# Altium schematic sheet Battery.SchDoc
size A3 portrait
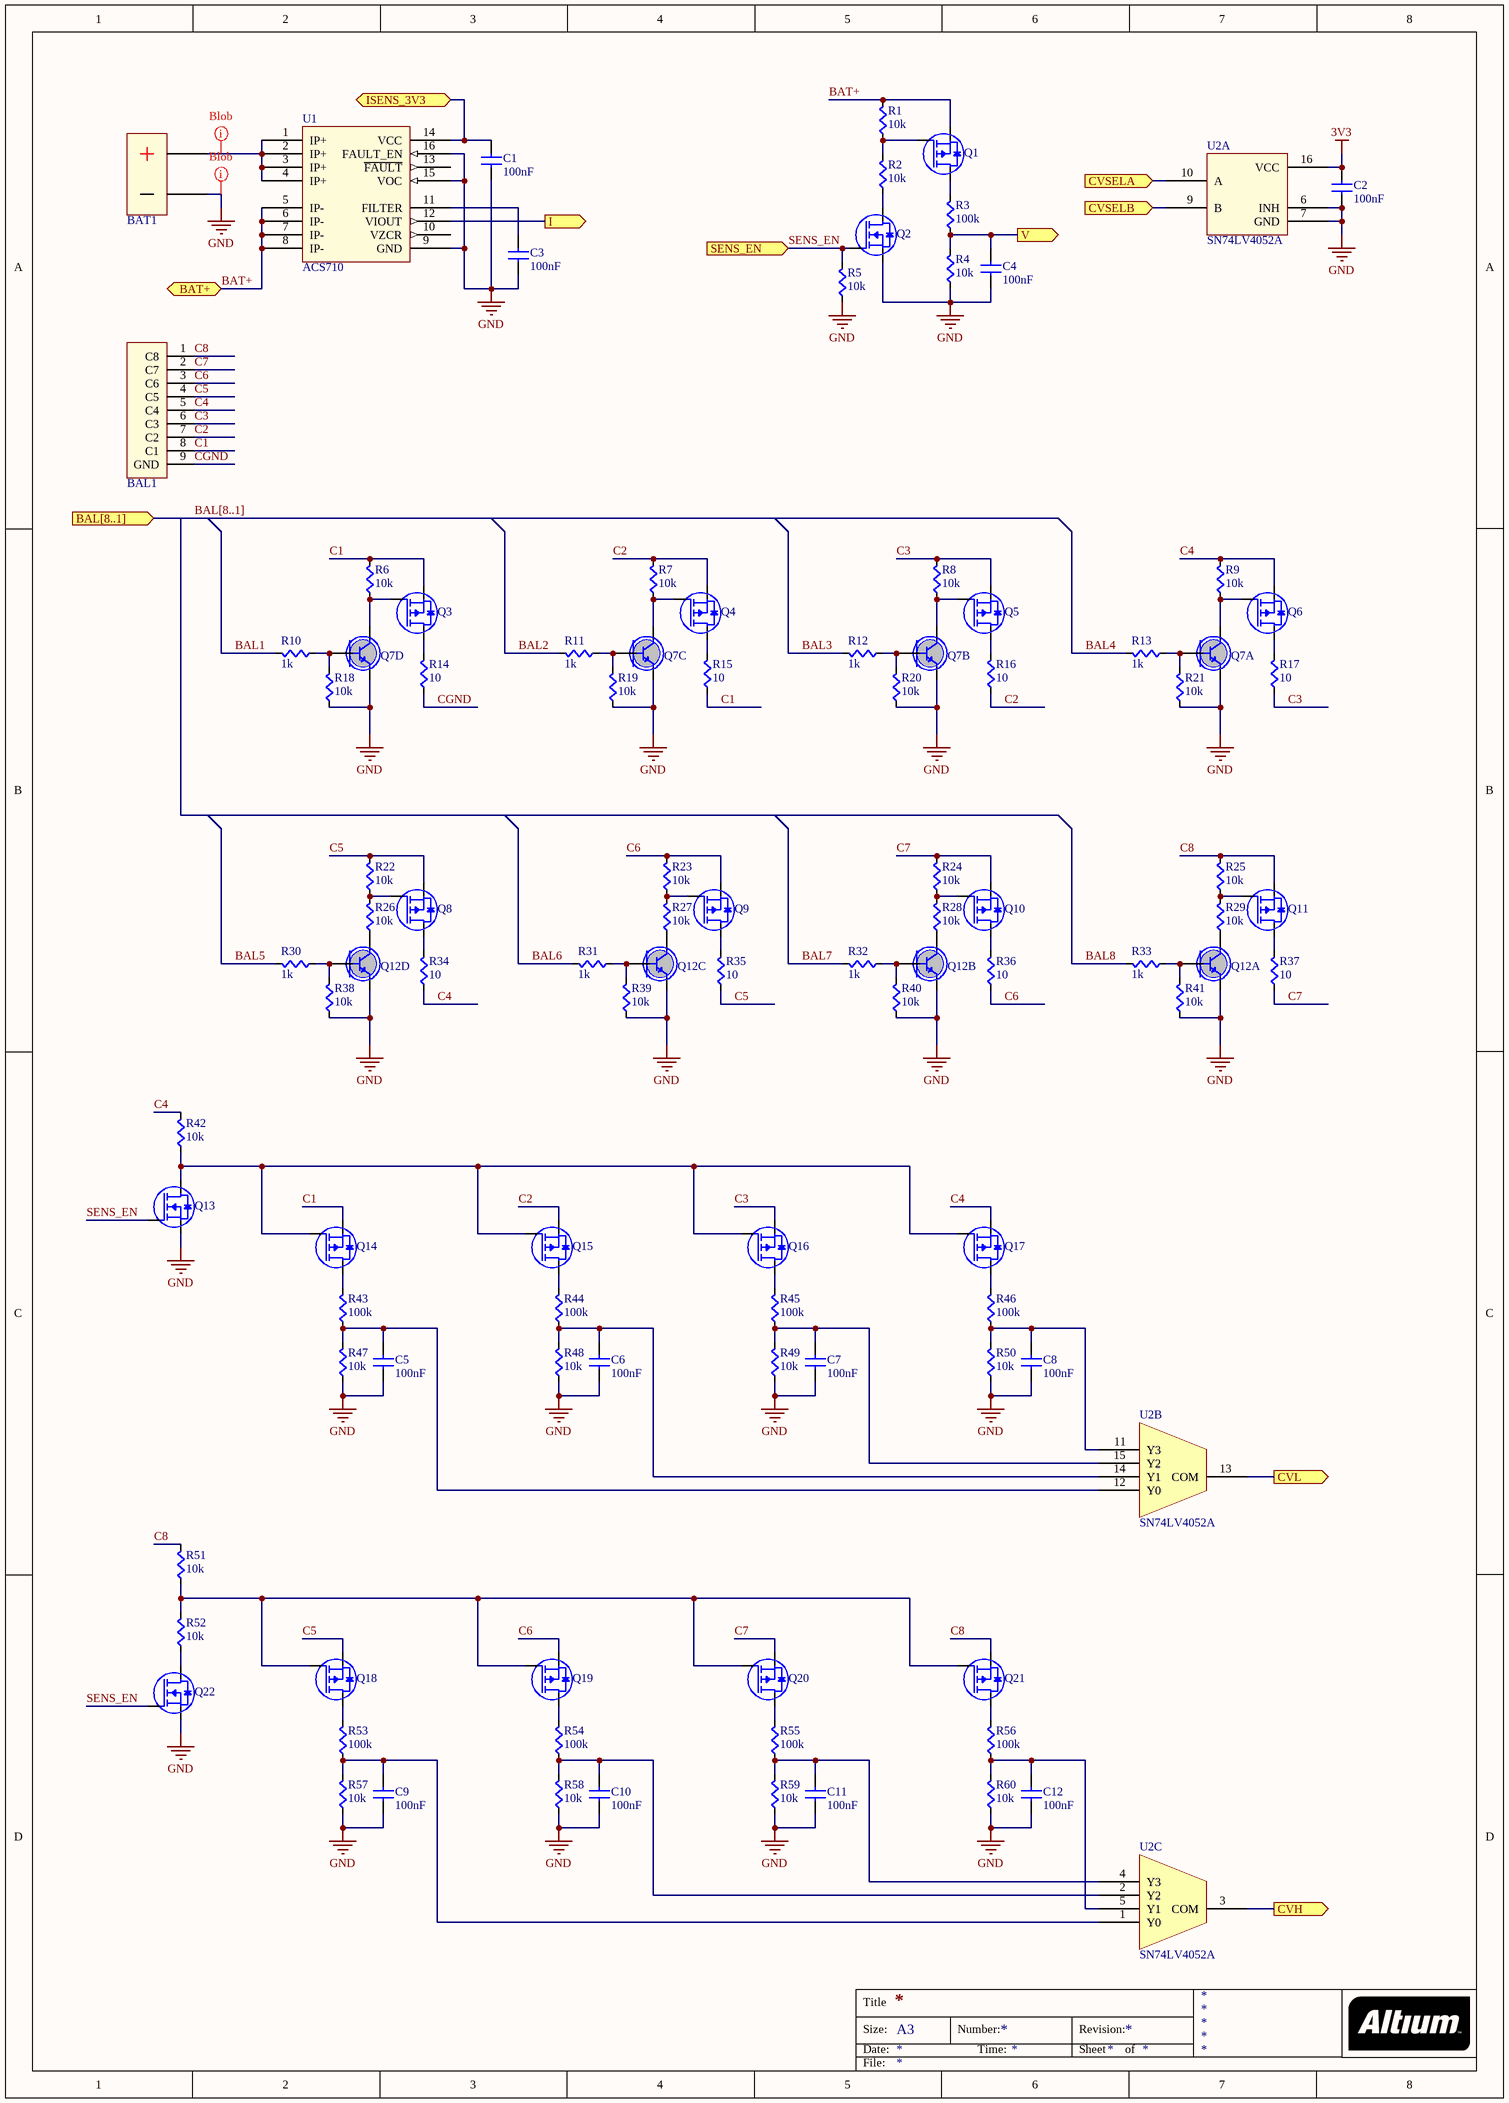
[diagram p0: Battery.SchDoc]

## Parts
BAL1  JST1x9  [JST1x9]  (value not drawn)
BAT1  BATWIRE  [BATWIRE12]  (value not drawn)
C1  value 100nF  [CAPC0603]  (hidden comment: Cap)
C2  value 100nF  [CAPC0603]  (hidden comment: Cap)
C3  value 100nF  [CAPC0603]  (hidden comment: Cap)
C4  value 100nF  [CAPC0603]  (hidden comment: Cap)
C5  value 100nF  [CAPC0603]  (hidden comment: Cap)
C6  value 100nF  [CAPC0603]  (hidden comment: Cap)
C7  value 100nF  [CAPC0603]  (hidden comment: Cap)
C8  value 100nF  [CAPC0603]  (hidden comment: Cap)
C9  value 100nF  [CAPC0603]  (hidden comment: Cap)
C10  value 100nF  [CAPC0603]  (hidden comment: Cap)
C11  value 100nF  [CAPC0603]  (hidden comment: Cap)
C12  value 100nF  [CAPC0603]  (hidden comment: Cap)
Q1  FDN5618P  [PowerSOT-3]  (value not drawn)
Q2  FDN5630  [PowerSOT-3]  (value not drawn)
Q3  FDN5618P  [PowerSOT-3]  (value not drawn)
Q4  FDN5618P  [PowerSOT-3]  (value not drawn)
Q5  FDN5618P  [PowerSOT-3]  (value not drawn)
Q6  FDN5618P  [PowerSOT-3]  (value not drawn)
Q7  MMPQ2222A  [MMPQ2222A]  (value not drawn)  (parts A,B,C,D of 4)
Q8  FDN5618P  [PowerSOT-3]  (value not drawn)
Q9  FDN5618P  [PowerSOT-3]  (value not drawn)
Q10  FDN5618P  [PowerSOT-3]  (value not drawn)
Q11  FDN5618P  [PowerSOT-3]  (value not drawn)
Q12  MMPQ2222A  [MMPQ2222A]  (value not drawn)  (parts A,B,C,D of 4)
Q13  FDN5630  [PowerSOT-3]  (value not drawn)
Q14  FDN5618P  [PowerSOT-3]  (value not drawn)
Q15  FDN5618P  [PowerSOT-3]  (value not drawn)
Q16  FDN5618P  [PowerSOT-3]  (value not drawn)
Q17  FDN5618P  [PowerSOT-3]  (value not drawn)
Q18  FDN5618P  [PowerSOT-3]  (value not drawn)
Q19  FDN5618P  [PowerSOT-3]  (value not drawn)
Q20  FDN5618P  [PowerSOT-3]  (value not drawn)
Q21  FDN5618P  [PowerSOT-3]  (value not drawn)
Q22  FDN5630  [PowerSOT-3]  (value not drawn)
R1  value 10k  [RES0603]  (hidden comment: Res)
R2  value 10k  [RES0603]  (hidden comment: Res)
R3  value 100k  [RES0603]  (hidden comment: Res)
R4  value 10k  [RES0603]  (hidden comment: Res)
R5  value 10k  [RES0603]  (hidden comment: Res)
R6  value 10k  [RES0603]  (hidden comment: Res)
R7  value 10k  [RES0603]  (hidden comment: Res)
R8  value 10k  [RES0603]  (hidden comment: Res)
R9  value 10k  [RES0603]  (hidden comment: Res)
R10  value 1k  [RES0603]  (hidden comment: Res)
R11  value 1k  [RES0603]  (hidden comment: Res)
R12  value 1k  [RES0603]  (hidden comment: Res)
R13  value 1k  [RES0603]  (hidden comment: Res)
R14  value 10  [FMP200]  (hidden comment: Res)
R15  value 10  [FMP200]  (hidden comment: Res)
R16  value 10  [FMP200]  (hidden comment: Res)
R17  value 10  [FMP200]  (hidden comment: Res)
R18  value 10k  [RES0603]  (hidden comment: Res)
R19  value 10k  [RES0603]  (hidden comment: Res)
R20  value 10k  [RES0603]  (hidden comment: Res)
R21  value 10k  [RES0603]  (hidden comment: Res)
R22  value 10k  [RES0603]  (hidden comment: Res)
R23  value 10k  [RES0603]  (hidden comment: Res)
R24  value 10k  [RES0603]  (hidden comment: Res)
R25  value 10k  [RES0603]  (hidden comment: Res)
R26  value 10k  [RES0603]  (hidden comment: Res)
R27  value 10k  [RES0603]  (hidden comment: Res)
R28  value 10k  [RES0603]  (hidden comment: Res)
R29  value 10k  [RES0603]  (hidden comment: Res)
R30  value 1k  [RES0603]  (hidden comment: Res)
R31  value 1k  [RES0603]  (hidden comment: Res)
R32  value 1k  [RES0603]  (hidden comment: Res)
R33  value 1k  [RES0603]  (hidden comment: Res)
R34  value 10  [FMP200]  (hidden comment: Res)
R35  value 10  [FMP200]  (hidden comment: Res)
R36  value 10  [FMP200]  (hidden comment: Res)
R37  value 10  [FMP200]  (hidden comment: Res)
R38  value 10k  [RES0603]  (hidden comment: Res)
R39  value 10k  [RES0603]  (hidden comment: Res)
R40  value 10k  [RES0603]  (hidden comment: Res)
R41  value 10k  [RES0603]  (hidden comment: Res)
R42  value 10k  [RES0603]  (hidden comment: Res)
R43  value 100k  [RES0603]  (hidden comment: Res)
R44  value 100k  [RES0603]  (hidden comment: Res)
R45  value 100k  [RES0603]  (hidden comment: Res)
R46  value 100k  [RES0603]  (hidden comment: Res)
R47  value 10k  [RES0603]  (hidden comment: Res)
R48  value 10k  [RES0603]  (hidden comment: Res)
R49  value 10k  [RES0603]  (hidden comment: Res)
R50  value 10k  [RES0603]  (hidden comment: Res)
R51  value 10k  [RES0603]  (hidden comment: Res)
R52  value 10k  [RES0603]  (hidden comment: Res)
R53  value 100k  [RES0603]  (hidden comment: Res)
R54  value 100k  [RES0603]  (hidden comment: Res)
R55  value 100k  [RES0603]  (hidden comment: Res)
R56  value 100k  [RES0603]  (hidden comment: Res)
R57  value 10k  [RES0603]  (hidden comment: Res)
R58  value 10k  [RES0603]  (hidden comment: Res)
R59  value 10k  [RES0603]  (hidden comment: Res)
R60  value 10k  [RES0603]  (hidden comment: Res)
U1  ACS710  [ACS710_NOPIN]
U2  SN74LV4052A  [SN74LV4052AD]  (parts A,B,C of 3)

## Ports
BAL[8..1] (in), BAT+ (bidir), CVH (out), CVL (out), CVSELA (in), CVSELB (in), I (out), ISENS_3V3, SENS_EN (in), V (out)

## Nets
3V3: C2.1(A) U2.16(VCC)
GND: BAT1.- C1.2(B) C2.2(B) C3.2(B) C4.2(B) C5.2(B) C6.2(B) C7.2(B) C8.2(B) C9.2(B) C10.2(B) C11.2(B) C12.2(B) Q2.S Q7.10(E4) Q7.12(E3) Q7.14(E2) Q7.16(E1) Q12.10(E4) Q12.12(E3) Q12.14(E2) Q12.16(E1) Q13.S Q22.S R4.2(B) R5.2(B) R18.2(B) R19.2(B) R20.2(B) R21.2(B) R38.2(B) R39.2(B) R40.2(B) R41.2(B) R47.2(B) R48.2(B) R49.2(B) R50.2(B) R57.2(B) R58.2(B) R59.2(B) R60.2(B) U1.9(GND) U1.15(VOC) U1.16(FAULT_EN) U2.6(INH) U2.7(GND)
BAL1: R10.1(A)
BAL2: R11.1(A)
BAL3: R12.1(A)
BAL4: R13.1(A)
BAL5: R30.1(A)
BAL6: R31.1(A)
BAL7: R32.1(A)
BAL8: R33.1(A)
BAT+: Q1.S R1.1(A) U1.5(IP-) U1.6(IP-) U1.7(IP-) U1.8(IP-) ; port BAT+
C1: BAL1.8(C1) Q3.S Q14.S R6.1(A) R15.2(B)
C2: BAL1.7(C2) Q4.S Q15.S R7.1(A) R16.2(B)
C3: BAL1.6(C3) Q5.S Q16.S R8.1(A) R17.2(B)
C4: BAL1.5(C4) Q6.S Q17.S R9.1(A) R34.2(B) R42.1(A)
C5: BAL1.4(C5) Q8.S Q18.S R22.1(A) R35.2(B)
C6: BAL1.3(C6) Q9.S Q19.S R23.1(A) R36.2(B)
C7: BAL1.2(C7) Q10.S Q20.S R24.1(A) R37.2(B)
C8: BAL1.1(C8) Q11.S Q21.S R25.1(A) R51.1(A)
CGND: BAL1.9(GND) R14.2(B)
CVH: U2.3(COM) ; port CVH
CVL: U2.13(COM) ; port CVL
CVSELA: U2.10(A) ; port CVSELA
CVSELB: U2.9(B) ; port CVSELB
I: U1.12(VIOUT) ; port I
ISENS_3V3: C1.1(A) U1.14(VCC) ; port ISENS_3V3
SENS_EN: Q2.G Q13.G Q22.G R5.1(A) ; port SENS_EN
V: C4.1(A) R3.2(B) R4.1(A) ; port V
NetBAT1_+: BAT1.+ U1.1(IP+) U1.2(IP+) U1.3(IP+) U1.4(IP+)
NetC3_1: C3.1(A) U1.11(FILTER)
NetC5_1: C5.1(A) R43.2(B) R47.1(A) U2.12(Y0)
NetC6_1: C6.1(A) R44.2(B) R48.1(A) U2.14(Y1)
NetC7_1: C7.1(A) R45.2(B) R49.1(A) U2.15(Y2)
NetC8_1: C8.1(A) R46.2(B) R50.1(A) U2.11(Y3)
NetC9_1: C9.1(A) R53.2(B) R57.1(A) U2.1(Y0)
NetC10_1: C10.1(A) R54.2(B) R58.1(A) U2.2(Y2)
NetC11_1: C11.1(A) R55.2(B) R59.1(A) U2.4(Y3)
NetC12_1: C12.1(A) R56.2(B) R60.1(A) U2.5(Y1)
NetQ1_D: Q1.D R3.1(A)
NetQ1_G: Q1.G R1.2(B) R2.1(A)
NetQ2_D: Q2.D R2.2(B)
NetQ3_D: Q3.D R14.1(A)
NetQ3_G: Q3.G Q7.7(C4) R6.2(B)
NetQ4_D: Q4.D R15.1(A)
NetQ4_G: Q4.G Q7.5(C3) R7.2(B)
NetQ5_D: Q5.D R16.1(A)
NetQ5_G: Q5.G Q7.3(C2) R8.2(B)
NetQ6_D: Q6.D R17.1(A)
NetQ6_G: Q6.G Q7.1(C1) R9.2(B)
NetQ7_9: Q7.9(B4) R10.2(B) R18.1(A)
NetQ7_11: Q7.11(B3) R11.2(B) R19.1(A)
NetQ7_13: Q7.13(B2) R12.2(B) R20.1(A)
NetQ7_15: Q7.15(B1) R13.2(B) R21.1(A)
NetQ8_D: Q8.D R34.1(A)
NetQ8_G: Q8.G R22.2(B) R26.1(A)
NetQ9_D: Q9.D R35.1(A)
NetQ9_G: Q9.G R23.2(B) R27.1(A)
NetQ10_D: Q10.D R36.1(A)
NetQ10_G: Q10.G R24.2(B) R28.1(A)
NetQ11_D: Q11.D R37.1(A)
NetQ11_G: Q11.G R25.2(B) R29.1(A)
NetQ12_1: Q12.1(C1) R29.2(B)
NetQ12_3: Q12.3(C2) R28.2(B)
NetQ12_5: Q12.5(C3) R27.2(B)
NetQ12_7: Q12.7(C4) R26.2(B)
NetQ12_9: Q12.9(B4) R30.2(B) R38.1(A)
NetQ12_11: Q12.11(B3) R31.2(B) R39.1(A)
NetQ12_13: Q12.13(B2) R32.2(B) R40.1(A)
NetQ12_15: Q12.15(B1) R33.2(B) R41.1(A)
NetQ13_D: Q13.D Q14.G Q15.G Q16.G Q17.G R42.2(B)
NetQ14_D: Q14.D R43.1(A)
NetQ15_D: Q15.D R44.1(A)
NetQ16_D: Q16.D R45.1(A)
NetQ17_D: Q17.D R46.1(A)
NetQ18_D: Q18.D R53.1(A)
NetQ18_G: Q18.G Q19.G Q20.G Q21.G R51.2(B) R52.1(A)
NetQ19_D: Q19.D R54.1(A)
NetQ20_D: Q20.D R55.1(A)
NetQ21_D: Q21.D R56.1(A)
NetQ22_D: Q22.D R52.2(B)

Not connected (* = marked no-connect by the designer): U1 10(VZCR) 13(~{FAULT})

## Buses and harness runs
bus BAL[8..1] = port BAL[8..1]

## Layout directives
net class Blob: GND, NetBAT1_+

## Notes on the sheet
- Title
- Size:
- Date:
- A3
- Number:
- Time:
- Revision:
- Sheet
- of
- File:

## Library data of the parts
BAT1 = BATWIRE: Two large gauge leads soldered directly to the board.
Q1 Q3-Q6 Q8-Q11 Q14-Q21 = FDN5618P: 60V P-Channel Logic Level PowerTrench MOSFET; Supplier 1: Digi-Key; Supplier Part Number 1: FDN5618PCT-ND
Q2 Q13 Q22 = FDN5630: 60V N-Channel PowerTrench MOSFET; Supplier 1: Digi-Key; Supplier Part Number 1: FDN5630CT-ND
Q7 Q12 = MMPQ2222A: Quad NPN General Purpose Amplifier; Supplier 1: Digi-Key; Supplier Part Number 1: MMPQ2222ACT-ND
U1 = ACS710: Current Sensor with Integrated Overcurrent Detection; Supplier 1: Digi-Key; Supplier Part Number 1: 620-1334-1-ND
U2 = SN74LV4052A: Dual 4-Channel Analog Multiplexers/Demultiplexers; Supplier 1: Digi-Key; Supplier Part Number 1: 296-16707-1-ND
BAL1 = JST1x9: Supplier 1: Digi-Key; Supplier Part Number 1: 455-2224-ND
C1-C12 = Cap: Supplier 1: Digi-Key; Supplier Part Number 1: 1276-1000-1-ND
R1-R60 = Res: Supplier 1: Digi-Key
  R1 R2 R6-R9 R18-R29 R38-R42 R51 R52: Supplier Part Number 1: RMCF0603JT10K0CT-ND
  R3 R43-R46 R53-R56: Supplier Part Number 1: RR08P100KDCT-ND
  R4 R5 R47-R50 R57-R60: Supplier Part Number 1: RR08P10.0KDCT-ND
  R10-R13 R30-R33: Supplier Part Number 1: RHM1.0KGCT-ND
  R14-R17 R34-R37: Supplier Part Number 1: 10ZCT-ND